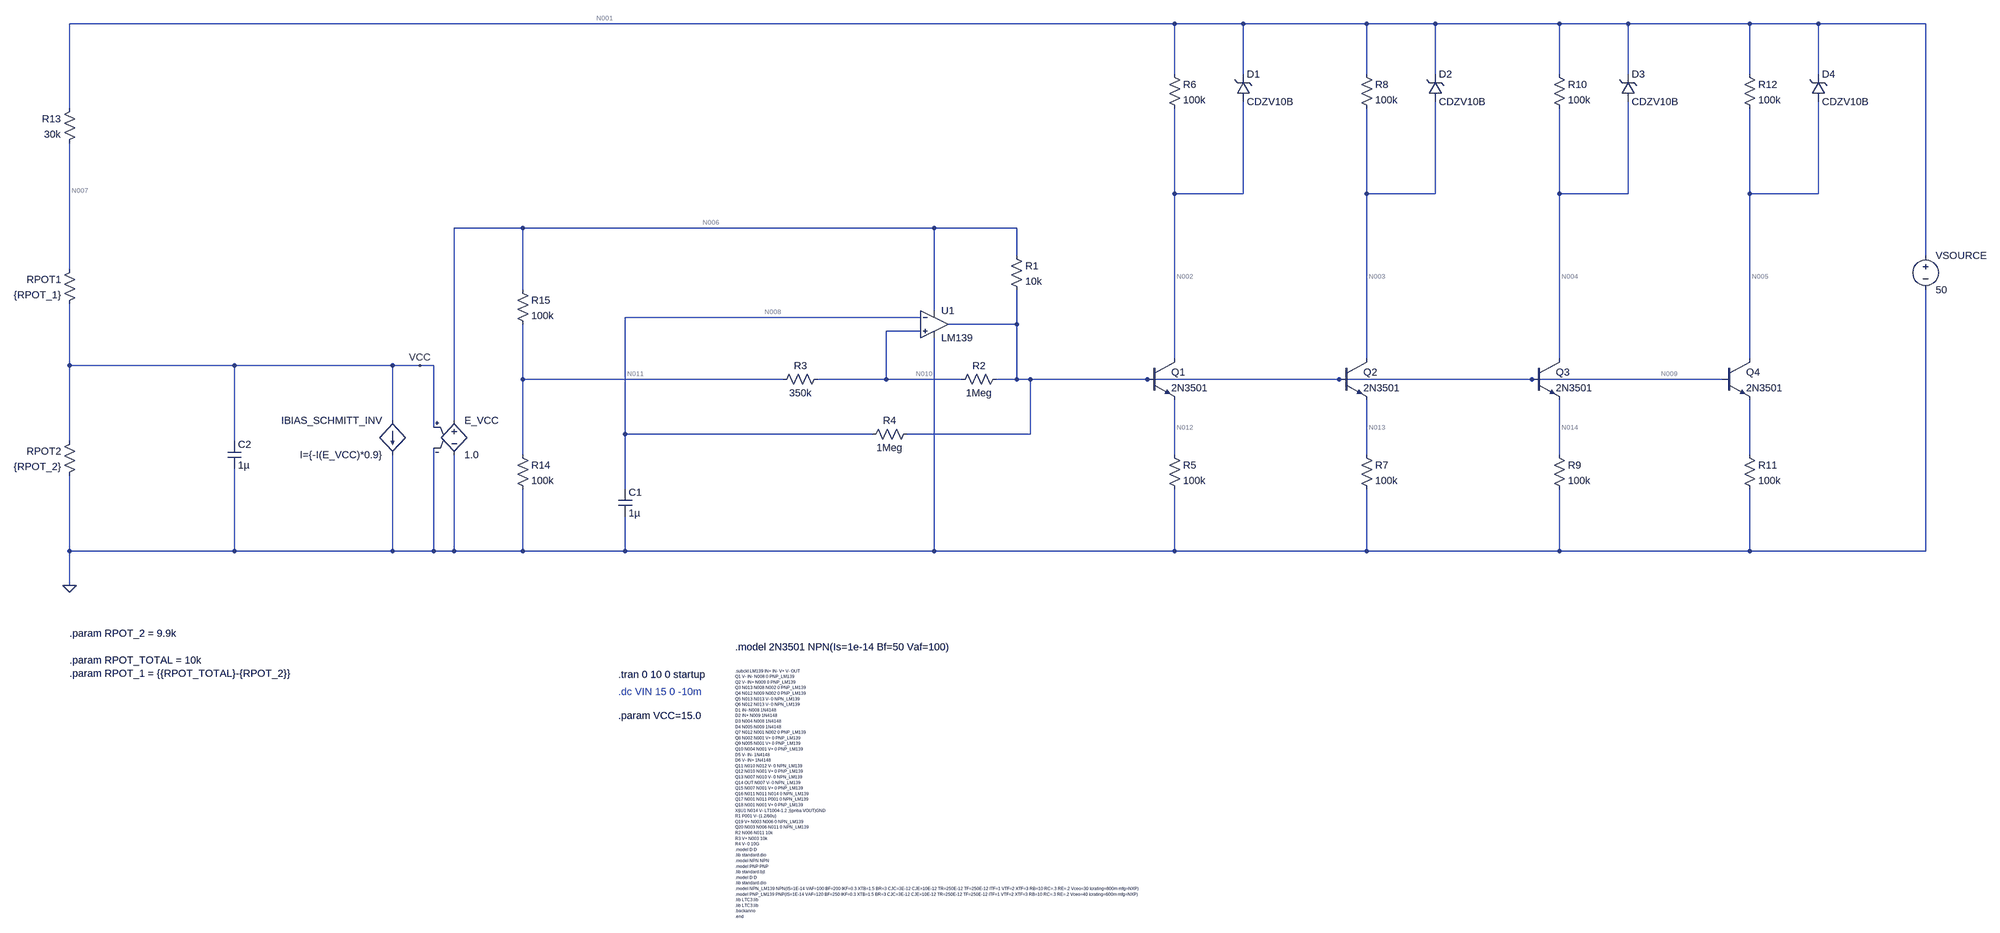
[diagram p0: schematic PMOS_Tester_Simple_SPICE_Sim.asc]
PMOS_Tester_Simple_SPICE_Sim.asc, the LTspice schematic file:
Version 4.1
SHEET 1 4000 1388
WIRE 624 -1040 -2032 -1040
WIRE 784 -1040 624 -1040
WIRE 1168 -1040 784 -1040
WIRE 1328 -1040 1168 -1040
WIRE 1792 -1040 1328 -1040
WIRE 1952 -1040 1792 -1040
WIRE 2432 -1040 1952 -1040
WIRE 2592 -1040 2432 -1040
WIRE 3200 -1040 2592 -1040
WIRE 624 -848 624 -1040
WIRE 784 -848 784 -1040
WIRE 1168 -848 1168 -1040
WIRE 1328 -848 1328 -1040
WIRE 1792 -848 1792 -1040
WIRE 1952 -848 1952 -1040
WIRE 2432 -848 2432 -1040
WIRE 2592 -848 2592 -1040
WIRE -2032 -768 -2032 -1040
WIRE 624 -496 624 -768
WIRE 784 -496 784 -784
WIRE 784 -496 624 -496
WIRE 1168 -496 1168 -768
WIRE 1328 -496 1328 -784
WIRE 1328 -496 1168 -496
WIRE 1792 -496 1792 -768
WIRE 1952 -496 1952 -784
WIRE 1952 -496 1792 -496
WIRE 2432 -496 2432 -768
WIRE 2592 -496 2592 -784
WIRE 2592 -496 2432 -496
WIRE -976 -416 -1136 -416
WIRE 64 -416 -976 -416
WIRE 256 -416 64 -416
WIRE 256 -352 256 -416
WIRE 3200 -352 3200 -1040
WIRE -2032 -320 -2032 -688
WIRE -976 -272 -976 -416
WIRE 64 -224 64 -416
WIRE 32 -208 -656 -208
WIRE 256 -192 256 -272
WIRE 256 -192 96 -192
WIRE 32 -176 -48 -176
WIRE 624 -112 624 -496
WIRE 1168 -112 1168 -496
WIRE 1792 -112 1792 -496
WIRE 2432 -112 2432 -496
WIRE -2032 -96 -2032 -240
WIRE -1648 -96 -2032 -96
WIRE -1280 -96 -1648 -96
WIRE -1216 -96 -1280 -96
WIRE -1184 -96 -1216 -96
WIRE -976 -64 -976 -192
WIRE -288 -64 -976 -64
WIRE -48 -64 -48 -176
WIRE -48 -64 -208 -64
WIRE 128 -64 -48 -64
WIRE 256 -64 256 -192
WIRE 256 -64 208 -64
WIRE 288 -64 256 -64
WIRE 560 -64 288 -64
WIRE 1104 -64 560 -64
WIRE 1728 -64 1104 -64
WIRE 2368 -64 1728 -64
WIRE -1280 32 -1280 -96
WIRE -1136 32 -1136 -416
WIRE -1184 48 -1184 -96
WIRE -656 64 -656 -208
WIRE -80 64 -656 64
WIRE 288 64 288 -64
WIRE 288 64 0 64
WIRE -2032 80 -2032 -96
WIRE -1648 80 -1648 -96
WIRE -976 112 -976 -64
WIRE 624 112 624 -16
WIRE 1168 112 1168 -16
WIRE 1792 112 1792 -16
WIRE 2432 112 2432 -16
WIRE -656 192 -656 64
WIRE -2032 336 -2032 160
WIRE -1648 336 -1648 144
WIRE -1648 336 -2032 336
WIRE -1280 336 -1280 112
WIRE -1280 336 -1648 336
WIRE -1184 336 -1184 96
WIRE -1184 336 -1280 336
WIRE -1136 336 -1136 112
WIRE -1136 336 -1184 336
WIRE -976 336 -976 192
WIRE -976 336 -1136 336
WIRE -656 336 -656 256
WIRE -656 336 -976 336
WIRE 64 336 64 -160
WIRE 64 336 -656 336
WIRE 624 336 624 192
WIRE 624 336 64 336
WIRE 1168 336 1168 192
WIRE 1168 336 624 336
WIRE 1792 336 1792 192
WIRE 1792 336 1168 336
WIRE 2432 336 2432 192
WIRE 2432 336 1792 336
WIRE 3200 336 3200 -272
WIRE 3200 336 2432 336
WIRE -2032 416 -2032 336
FLAG -2032 416 0
FLAG -1216 -96 VCC
SYMBOL OpAmps\\opamp2 64 -256 R0
SYMATTR InstName U1
SYMATTR Value LM139
SYMBOL res 240 -368 R0
SYMATTR InstName R1
SYMATTR Value 10k
SYMBOL res 224 -80 R90
WINDOW 0 0 56 VBottom 2
WINDOW 3 32 56 VTop 2
SYMATTR InstName R2
SYMATTR Value 1Meg
SYMBOL res -304 -48 R270
WINDOW 0 32 56 VTop 2
WINDOW 3 0 56 VBottom 2
SYMATTR InstName R3
SYMATTR Value 350k
SYMBOL res -96 80 R270
WINDOW 0 32 56 VTop 2
WINDOW 3 0 56 VBottom 2
SYMATTR InstName R4
SYMATTR Value 1Meg
SYMBOL cap -672 192 R0
SYMATTR InstName C1
SYMATTR Value 1µ
SYMBOL e -1136 16 R0
SYMATTR InstName E_VCC
SYMATTR Value 1.0
SYMBOL bi -1280 32 M0
SYMATTR InstName IBIAS_SCHMITT_INV
SYMATTR Value I={-I(E_VCC)*0.9}
SYMBOL npn 560 -112 R0
SYMATTR InstName Q1
SYMATTR Value 2N3501
SYMBOL res 608 96 R0
SYMATTR InstName R5
SYMATTR Value 100k
SYMBOL res 608 -864 R0
SYMATTR InstName R6
SYMATTR Value 100k
SYMBOL zener 768 -784 M180
WINDOW 0 24 64 Left 2
WINDOW 3 24 0 Left 2
SYMATTR InstName D1
SYMATTR Value CDZV10B
SYMBOL npn 1104 -112 R0
SYMATTR InstName Q2
SYMATTR Value 2N3501
SYMBOL res 1152 96 R0
SYMATTR InstName R7
SYMATTR Value 100k
SYMBOL res 1152 -864 R0
SYMATTR InstName R8
SYMATTR Value 100k
SYMBOL zener 1312 -784 M180
WINDOW 0 24 64 Left 2
WINDOW 3 24 0 Left 2
SYMATTR InstName D2
SYMATTR Value CDZV10B
SYMBOL npn 1728 -112 R0
SYMATTR InstName Q3
SYMATTR Value 2N3501
SYMBOL res 1776 96 R0
SYMATTR InstName R9
SYMATTR Value 100k
SYMBOL res 1776 -864 R0
SYMATTR InstName R10
SYMATTR Value 100k
SYMBOL zener 1936 -784 M180
WINDOW 0 24 64 Left 2
WINDOW 3 24 0 Left 2
SYMATTR InstName D3
SYMATTR Value CDZV10B
SYMBOL npn 2368 -112 R0
SYMATTR InstName Q4
SYMATTR Value 2N3501
SYMBOL res 2416 96 R0
SYMATTR InstName R11
SYMATTR Value 100k
SYMBOL res 2416 -864 R0
SYMATTR InstName R12
SYMATTR Value 100k
SYMBOL zener 2576 -784 M180
WINDOW 0 24 64 Left 2
WINDOW 3 24 0 Left 2
SYMATTR InstName D4
SYMATTR Value CDZV10B
SYMBOL voltage 3200 -368 R0
WINDOW 123 0 0 Left 0
WINDOW 39 0 0 Left 0
SYMATTR InstName VSOURCE
SYMATTR Value 50
SYMBOL res -2016 -336 M0
SYMATTR InstName RPOT1
SYMATTR Value {RPOT_1}
SYMBOL res -2016 64 M0
SYMATTR InstName RPOT2
SYMATTR Value {RPOT_2}
SYMBOL res -2016 -784 M0
SYMATTR InstName R13
SYMATTR Value 30k
SYMBOL cap -1664 80 R0
SYMATTR InstName C2
SYMATTR Value 1µ
SYMBOL res -992 96 R0
SYMATTR InstName R14
SYMATTR Value 100k
SYMBOL res -992 -288 R0
SYMATTR InstName R15
SYMATTR Value 100k
TEXT -400 616 Left 0 !.subckt LM139 IN+ IN- V+ V- OUT\nQ1 V- IN- N008 0 PNP_LM139\nQ2 V- IN+ N009 0 PNP_LM139\nQ3 N013 N008 N002 0 PNP_LM139\nQ4 N012 N009 N002 0 PNP_LM139\nQ5 N013 N013 V- 0 NPN_LM139\nQ6 N012 N013 V- 0 NPN_LM139\nD1 IN- N008 1N4148\nD2 IN+ N009 1N4148\nD3 N004 N008 1N4148\nD4 N005 N009 1N4148\nQ7 N012 N001 N002 0 PNP_LM139\nQ8 N002 N001 V+ 0 PNP_LM139\nQ9 N005 N001 V+ 0 PNP_LM139\nQ10 N004 N001 V+ 0 PNP_LM139\nD5 V- IN- 1N4148\nD6 V- IN+ 1N4148\nQ11 N010 N012 V- 0 NPN_LM139\nQ12 N010 N001 V+ 0 PNP_LM139\nQ13 N007 N010 V- 0 NPN_LM139\nQ14 OUT N007 V- 0 NPN_LM139\nQ15 N007 N001 V+ 0 PNP_LM139\nQ16 N011 N011 N014 0 NPN_LM139\nQ17 N001 N011 P001 0 NPN_LM139\nQ18 N001 N001 V+ 0 PNP_LM139\nX§U1 N014 V- LT1004-1.2 ;§pnba VOUT)GND\nR1 P001 V- {1.2/60u}\nQ19 V+ N003 N006 0 NPN_LM139\nQ20 N003 N006 N011 0 NPN_LM139\nR2 N006 N011 10k\nR3 V+ N003 10k\nR4 V- 0 10G\n.model D D\n.lib standard.dio\n.model NPN NPN\n.model PNP PNP\n.lib standard.bjt\n.model D D\n.lib standard.dio\n.model NPN_LM139 NPN(IS=1E-14 VAF=100 BF=200 IKF=0.3 XTB=1.5 BR=3 CJC=3E-12 CJE=10E-12 TR=250E-12 TF=250E-12 ITF=1 VTF=2 XTF=3 RB=10 RC=.3 RE=.2 Vceo=30 Icrating=800m mfg=NXP)\n.model PNP_LM139 PNP(IS=1E-14 VAF=120 BF=250 IKF=0.3 XTB=1.5 BR=3 CJC=3E-12 CJE=10E-12 TR=250E-12 TF=250E-12 ITF=1 VTF=2 XTF=3 RB=10 RC=.3 RE=.2 Vceo=40 Icrating=600m mfg=NXP)\n.lib LTC3.lib\n.lib LTC3.lib\n.backanno\n.end
TEXT -672 664 Left 2 ;.dc VIN 15 0 -10m
TEXT -672 624 Left 2 !.tran 0 10 0 startup
TEXT -672 720 Left 2 !.param VCC=15.0
TEXT -400 560 Left 2 !.model 2N3501 NPN(Is=1e-14 Bf=50 Vaf=100)
TEXT -2032 528 Left 2 !.param RPOT_2 = 9.9k\n \n.param RPOT_TOTAL = 10k\n.param RPOT_1 = {{RPOT_TOTAL}-{RPOT_2}}

The netlist it stands for:
* PMOS_Tester_Simple_SPICE_Sim.asc
X§U1 N010 N008 N006 0 N009 LM139  ; pins In+ In- V+ V- OUT
R1 N006 N009 10k
R2 N009 N010 1Meg
R3 N011 N010 350k
R4 N008 N009 1Meg
C1 N008 0 1µ
E_VCC N006 0 VCC 0 1.0
B§IBIAS_SCHMITT_INV VCC 0 I={-I(E_VCC)*0.9}
Q1 N002 N009 N012 0 2N3501
R5 N012 0 100k
R6 N001 N002 100k
D1 N002 N001 CDZV10B
Q2 N003 N009 N013 0 2N3501
R7 N013 0 100k
R8 N001 N003 100k
D2 N003 N001 CDZV10B
Q3 N004 N009 N014 0 2N3501
R9 N014 0 100k
R10 N001 N004 100k
D3 N004 N001 CDZV10B
Q4 N005 N009 N015 0 2N3501
R11 N015 0 100k
R12 N001 N005 100k
D4 N005 N001 CDZV10B
VSOURCE N001 0 50
RPOT1 N007 VCC {RPOT_1}
RPOT2 VCC 0 {RPOT_2}
R13 N001 N007 30k
C2 VCC 0 1µ
R14 N011 0 100k
R15 N006 N011 100k
.model D D
.lib standard.dio
.model NPN NPN
.model PNP PNP
.lib standard.bjt
.subckt LM139 IN+ IN- V+ V- OUT
Q1 V- IN- N008 0 PNP_LM139
Q2 V- IN+ N009 0 PNP_LM139
Q3 N013 N008 N002 0 PNP_LM139
Q4 N012 N009 N002 0 PNP_LM139
Q5 N013 N013 V- 0 NPN_LM139
Q6 N012 N013 V- 0 NPN_LM139
D1 IN- N008 1N4148
D2 IN+ N009 1N4148
D3 N004 N008 1N4148
D4 N005 N009 1N4148
Q7 N012 N001 N002 0 PNP_LM139
Q8 N002 N001 V+ 0 PNP_LM139
Q9 N005 N001 V+ 0 PNP_LM139
Q10 N004 N001 V+ 0 PNP_LM139
D5 V- IN- 1N4148
D6 V- IN+ 1N4148
Q11 N010 N012 V- 0 NPN_LM139
Q12 N010 N001 V+ 0 PNP_LM139
Q13 N007 N010 V- 0 NPN_LM139
Q14 OUT N007 V- 0 NPN_LM139
Q15 N007 N001 V+ 0 PNP_LM139
Q16 N011 N011 N014 0 NPN_LM139
Q17 N001 N011 P001 0 NPN_LM139
Q18 N001 N001 V+ 0 PNP_LM139
X§U1 N014 V- LT1004-1.2 ;§pnba VOUT)GND
R1 P001 V- {1.2/60u}
Q19 V+ N003 N006 0 NPN_LM139
Q20 N003 N006 N011 0 NPN_LM139
R2 N006 N011 10k
R3 V+ N003 10k
R4 V- 0 10G
.model D D
.lib standard.dio
.model NPN NPN
.model PNP PNP
.lib standard.bjt
.model D D
.lib standard.dio
.model NPN_LM139 NPN(IS=1E-14 VAF=100 BF=200 IKF=0.3 XTB=1.5 BR=3 CJC=3E-12 CJE=10E-12 TR=250E-12 TF=250E-12 ITF=1 VTF=2 XTF=3 RB=10 RC=.3 RE=.2 Vceo=30 Icrating=800m mfg=NXP)
.model PNP_LM139 PNP(IS=1E-14 VAF=120 BF=250 IKF=0.3 XTB=1.5 BR=3 CJC=3E-12 CJE=10E-12 TR=250E-12 TF=250E-12 ITF=1 VTF=2 XTF=3 RB=10 RC=.3 RE=.2 Vceo=40 Icrating=600m mfg=NXP)
.lib LTC3.lib
.lib LTC3.lib
.backanno
.end
* .dc VIN 15 0 -10m
.tran 0 10 0 startup
.param VCC=15.0
.model 2N3501 NPN(Is=1e-14 Bf=50 Vaf=100)
.param RPOT_2 = 9.9k
.param RPOT_TOTAL = 10k
.param RPOT_1 = {{RPOT_TOTAL}-{RPOT_2}}
.backanno
.end